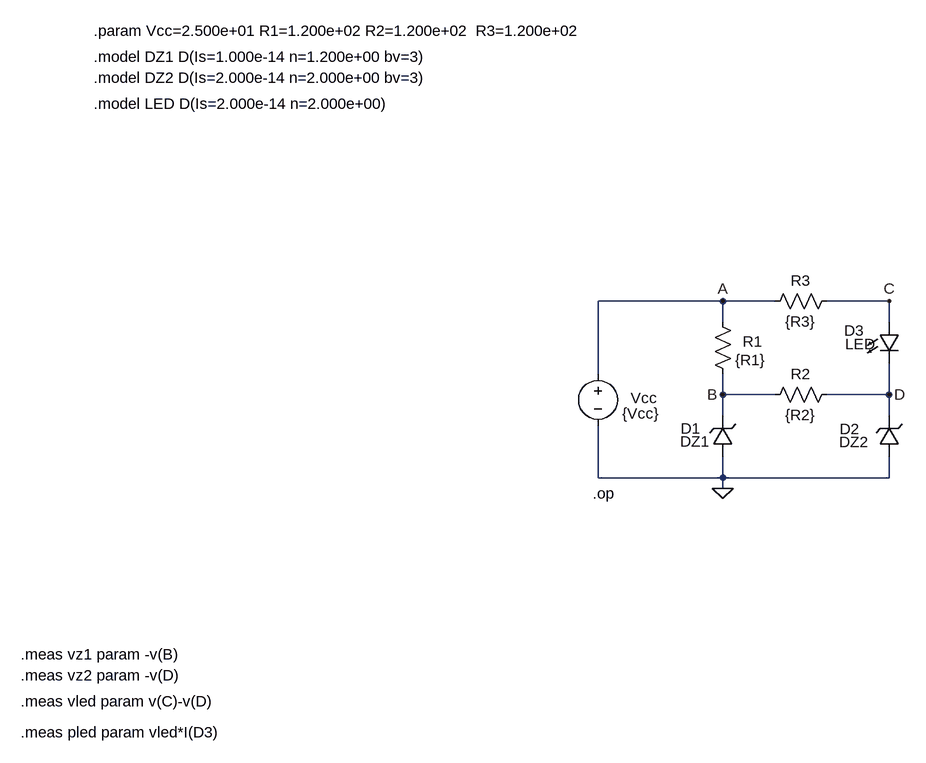
[diagram p0: schematic COMB02op.asc]
COMB02op.asc, the LTspice schematic file:
Version 4
SHEET 1 1624 1076
WIRE 1056 -192 864 -192
WIRE 1136 -192 1056 -192
WIRE 1312 -192 1216 -192
WIRE 1056 -160 1056 -192
WIRE 1312 -160 1312 -192
WIRE 864 -80 864 -192
WIRE 1056 -48 1056 -80
WIRE 1136 -48 1056 -48
WIRE 1312 -48 1312 -96
WIRE 1312 -48 1216 -48
WIRE 1056 -16 1056 -48
WIRE 1312 -16 1312 -48
WIRE 864 80 864 0
WIRE 1056 80 1056 48
WIRE 1056 80 864 80
WIRE 1312 80 1312 48
WIRE 1312 80 1056 80
WIRE 1056 96 1056 80
FLAG 1056 96 0
FLAG 1056 -48 B
FLAG 1312 -192 C
FLAG 1312 -48 D
FLAG 1056 -192 A
SYMBOL voltage 864 -96 R0
WINDOW 123 0 0 Left 0
WINDOW 39 0 0 Left 0
WINDOW 0 50 53 Left 2
WINDOW 3 37 77 Left 2
SYMATTR InstName Vcc
SYMATTR Value {Vcc}
SYMBOL res 1040 -176 R0
WINDOW 0 47 46 Left 2
WINDOW 3 35 75 Left 2
SYMATTR InstName R1
SYMATTR Value {R1}
SYMBOL res 1232 -64 R90
WINDOW 0 0 56 VBottom 2
WINDOW 3 32 56 VTop 2
SYMATTR InstName R2
SYMATTR Value {R2}
SYMBOL zener 1072 48 R180
WINDOW 0 50 44 Left 2
WINDOW 3 36 24 Left 2
SYMATTR InstName D1
SYMATTR Value DZ1
SYMBOL zener 1328 48 R180
WINDOW 0 61 43 Left 2
WINDOW 3 47 23 Left 2
SYMATTR InstName D2
SYMATTR Value DZ2
SYMBOL LED 1296 -160 R0
WINDOW 0 -53 13 Left 2
WINDOW 3 -52 34 Left 2
SYMATTR InstName D3
SYMATTR Value LED
SYMBOL res 1232 -208 R90
WINDOW 0 0 56 VBottom 2
WINDOW 3 32 56 VTop 2
SYMATTR InstName R3
SYMATTR Value {R3}
TEXT 856 104 Left 2 !.op
TEXT 88 -608 Left 2 !.param Vcc=2.500e+01 R1=1.200e+02 R2=1.200e+02  R3=1.200e+02
TEXT 88 -568 Left 2 !.model DZ1 D(Is=1.000e-14 n=1.200e+00 bv=3)
TEXT 88 -536 Left 2 !.model DZ2 D(Is=2.000e-14 n=2.000e+00 bv=3)
TEXT -24 352 Left 2 !.meas vz1 param -v(B)
TEXT -24 384 Left 2 !.meas vz2 param -v(D)
TEXT 88 -496 Left 2 !.model LED D(Is=2.000e-14 n=2.000e+00)
TEXT -24 424 Left 2 !.meas vled param v(C)-v(D)
TEXT -24 472 Left 2 !.meas pled param vled*I(D3)

The netlist it stands for:
* COMB02op.asc
Vcc A 0 {Vcc}
R1 A B {R1}
R2 D B {R2}
D1 0 B DZ1
D2 0 D DZ2
D3 C D LED
R3 C A {R3}
.model D D
.lib standard.dio
.op
.param Vcc=2.500e+01 R1=1.200e+02 R2=1.200e+02  R3=1.200e+02
.model DZ1 D(Is=1.000e-14 n=1.200e+00 bv=3)
.model DZ2 D(Is=2.000e-14 n=2.000e+00 bv=3)
.meas vz1 param -v(B)
.meas vz2 param -v(D)
.model LED D(Is=2.000e-14 n=2.000e+00)
.meas vled param v(C)-v(D)
.meas pled param vled*I(D3)
.backanno
.end